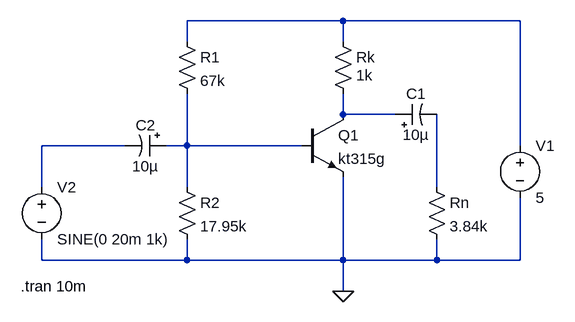
[diagram p0: schematic amplifier.asc]
amplifier.asc, the LTspice schematic file:
Version 4
SHEET 1 880 680
WIRE 368 -48 128 -48
WIRE 640 -48 368 -48
WIRE 128 -16 128 -48
WIRE 368 -16 368 -48
WIRE 368 96 368 64
WIRE 448 96 368 96
WIRE 32 144 -96 144
WIRE 128 144 128 64
WIRE 128 144 96 144
WIRE 304 144 128 144
WIRE 640 144 640 -48
WIRE -96 208 -96 144
WIRE 128 208 128 144
WIRE 512 208 512 96
WIRE -96 320 -96 288
WIRE 128 320 128 288
WIRE 128 320 -96 320
WIRE 368 320 368 192
WIRE 368 320 128 320
WIRE 512 320 512 288
WIRE 512 320 368 320
WIRE 640 320 640 224
WIRE 640 320 512 320
WIRE 368 368 368 320
FLAG 368 368 0
SYMBOL res 112 -32 R0
SYMATTR InstName R1
SYMATTR Value 67k
SYMBOL res 112 192 R0
SYMATTR InstName R2
SYMATTR Value 17.95k
SYMBOL res 352 -32 R0
WINDOW 3 36 68 Left 2
SYMATTR Value 1k
SYMATTR InstName Rk
SYMBOL res 496 192 R0
SYMATTR InstName Rn
SYMATTR Value 3.84k
SYMBOL voltage 640 128 R0
WINDOW 123 0 0 Left 2
WINDOW 39 0 0 Left 2
SYMATTR InstName V1
SYMATTR Value 5
SYMBOL voltage -96 192 R0
WINDOW 123 0 0 Left 2
WINDOW 39 0 0 Left 2
SYMATTR InstName V2
SYMATTR Value SINE(0 20m 1k)
SYMBOL polcap 448 112 R270
WINDOW 0 32 32 VTop 2
WINDOW 3 0 32 VBottom 2
SYMATTR InstName C1
SYMATTR Value 10µ
SYMBOL polcap 96 128 R90
WINDOW 0 0 32 VBottom 2
WINDOW 3 32 32 VTop 2
SYMATTR InstName C2
SYMATTR Value 10µ
SYMBOL npn 304 96 R0
SYMATTR InstName Q1
SYMATTR Value kt315g
TEXT -128 360 Left 2 !.tran 10m

The netlist it stands for:
* amplifier.asc
R1 N001 N004 67k
R2 N004 0 17.95k
Rk N001 N002 1k
Rn N005 0 3.84k
V1 N001 0 5
V2 N003 0 SINE(0 20m 1k)
C1 N002 N005 10µ
C2 N004 N003 10µ
Q1 N002 N004 0 0 kt315g
.model NPN NPN
.model PNP PNP
.lib standard.bjt
.tran 10m
.backanno
.end